# EAGLE design TubeAmp_driver (EAGLE 7.2.0)
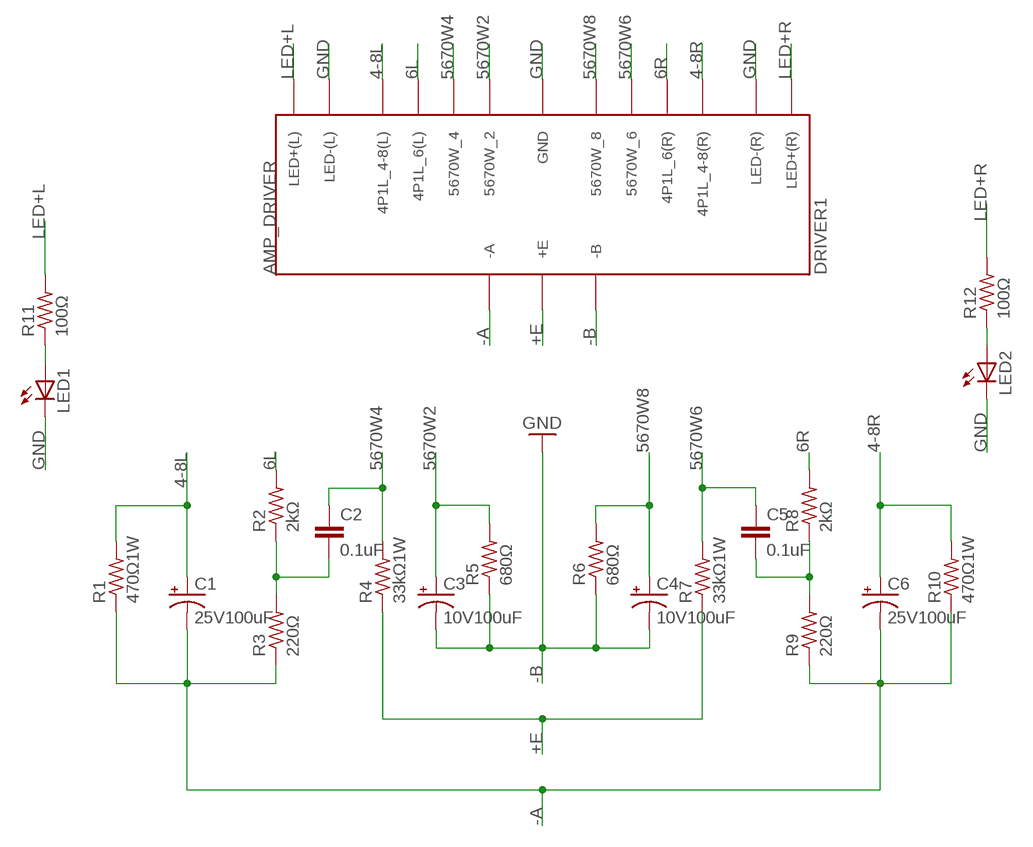
[diagram p0: schematic, sheet 1]

## Parts
C1  25V100uF  CAPACITOR2S3_NO_VALUE  [100UF25V_S3_NO_VALUE]
C2  0.1uF  CAPACITOR1C12.5_NO_VALUE  [C12.5B6_NO_VALUE]
C3  10V100uF  CAPACITOR2S3_NO_VALUE  [100UF25V_S3_NO_VALUE]
C4  10V100uF  CAPACITOR2S3_NO_VALUE  [100UF25V_S3_NO_VALUE]
C5  0.1uF  CAPACITOR1C12.5_NO_VALUE  [C12.5B6_NO_VALUE]
C6  25V100uF  CAPACITOR2S3_NO_VALUE  [100UF25V_S3_NO_VALUE]
DRIVER1  AMP_DRIVER  [AMP_DRIVER]
LED1  LED  [LED3MM]
LED2  LED  [LED3MM]
R1  470Ω1W  RESISTOR1W  [RESISTOR_1W]
R2  2kΩ  RESISTOR1/4W  [RESISTOR_1/4W]
R3  220Ω  RESISTOR1/4W  [RESISTOR_1/4W]
R4  33kΩ1W  RESISTOR1W  [RESISTOR_1W]
R5  680Ω  RESISTOR1/4W  [RESISTOR_1/4W]
R6  680Ω  RESISTOR1/4W  [RESISTOR_1/4W]
R7  33kΩ1W  RESISTOR1W  [RESISTOR_1W]
R8  2kΩ  RESISTOR1/4W  [RESISTOR_1/4W]
R9  220Ω  RESISTOR1/4W  [RESISTOR_1/4W]
R10  470Ω1W  RESISTOR1W  [RESISTOR_1W]
R11  100Ω  RESISTOR1/4W  [RESISTOR_1/4W]
R12  100Ω  RESISTOR1/4W  [RESISTOR_1/4W]

## Nets
4-8L [power]: C1.1(+) DRIVER1.4P1L_4-8L(4P1L_4-8(L)) R1.2
4-8R [power]: C6.1(+) DRIVER1.4P1L_4-8R(4P1L_4-8(R)) R10.2
6L [power]: DRIVER1.4P1L_6L(4P1L_6(L)) R2.2
6R [power]: DRIVER1.4P1L_6R(4P1L_6(R)) R8.2
5670W2 [power]: C3.1(+) DRIVER1.5670W_2 R5.2
5670W4 [power]: C2.1 DRIVER1.5670W_4 R4.2
5670W6 [GND]: C5.1 DRIVER1.5670W_6 R7.2
5670W8 [power]: C4.1(+) DRIVER1.5670W_8 R6.2
+E [power]: DRIVER1.+E R4.1 R7.1
-A [power]: C1.2(-) C6.2(-) DRIVER1.-A R1.1 R3.1 R9.1 R10.1
-B [GND]: C3.2(-) C4.2(-) DRIVER1.-B R5.1 R6.1 ; supply symbol labelled GND
GND [power]: DRIVER1.GND DRIVER1.LED-_L(LED-(L)) DRIVER1.LED-_R(LED-(R)) LED1.K(C) LED2.K(C)
LED+L: DRIVER1.LED+_L(LED+(L)) R11.2
LED+R: DRIVER1.LED+_R(LED+(R)) R12.2
N$2 [power]: C2.2 R2.1 R3.2
N$6: LED1.A R11.1
N$7: LED2.A R12.1
N$11 [power]: C5.2 R8.1 R9.2

## Library data of the parts
C1 C3 C4 C6 = mylib:CAPACITOR2
C2 C5 = mylib:CAPACITOR1
DRIVER1 = mylib:AMP_DRIVER
LED1 LED2 = mylib:LED
R1-R12 = mylib:RESISTOR

## Net classes
1 GND: width 0.381 mm, drill 0.152 mm
2 power: width 0.381 mm, drill 0.127 mm
3 edit: width 0.051 mm, drill 0.025 mm

## Board
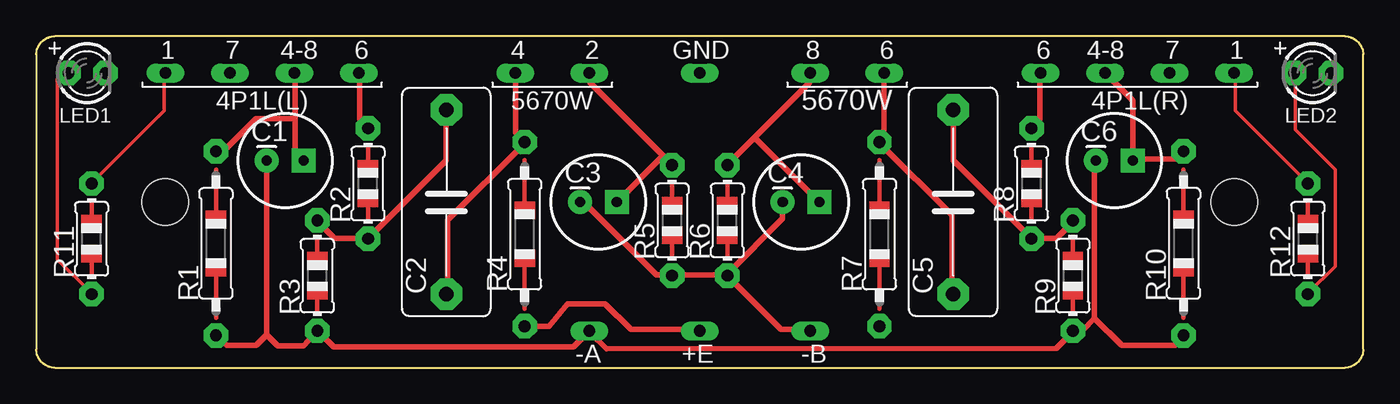
[diagram p1: board, top side]
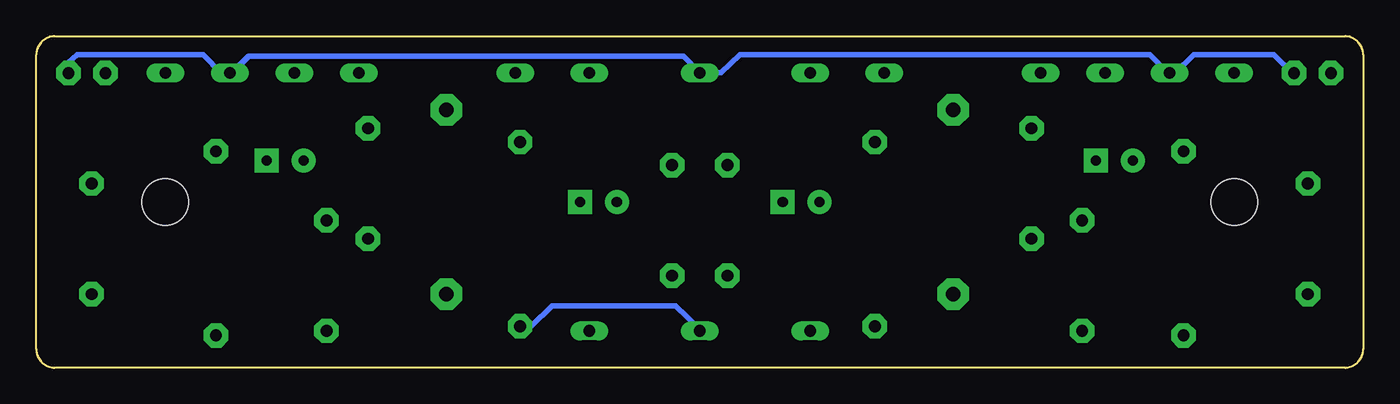
[diagram p2: board, bottom side, seen from below]

Size 91.44 x 22.86 mm. Coordinates in mm from the lower left corner, seen from the top.
Copper layers (1*16): Top 0.035mm / dielectric 1.5mm / Bottom 0.035mm
Design rules "default": minimum track width 10mil, minimum drill 24mil, track to track 8mil, track to pad 8mil, pad to pad 8mil, via to via 8mil, smd to smd 8mil, copper to edge 40mil, drill to drill 8mil, minimum pad ring 10mil, minimum via ring 8mil, stop-mask expansion 4mil, vias tented up to drill 0mil, thermal gap 10mil

### Footprints (pad centres in the part's own frame; a part is rotated, then mirrored left to right if it is on the bottom)
100UF25V_S3_NO_VALUE = drill 0.7 pad 1.651 square: 1 1.27,0 | drill 0.7 pad 1.651: 2 -1.27,0
C12.5B6_NO_VALUE = drill 1.016 pad 2.159 octagon: 1 1.27,2.54; 2 13.97,2.54
AMP_DRIVER = drill 0.8 long: 4P1L_4-8L 17.78,20.32; 4P1L_4-8R 73.66,20.32; 4P1L_6L 22.225,20.32; 4P1L_6R 69.215,20.32; 5670W_2 38.1,20.32; 5670W_4 33.02,20.32; 5670W_6 58.42,20.32; 5670W_8 53.34,20.32; +E 45.72,2.54; -A 38.1,2.54; -B 53.34,2.54; GND 45.72,20.32; LED+_L 8.89,20.32; LED+_R 82.55,20.32; LED-_L 13.335,20.32; LED-_R 78.105,20.32 | hole 3.2: 8.89,11.43; 82.55,11.43
LED3MM = drill 0.813 pad 1.676 octagon: A -1.27,0; K 1.27,0
RESISTOR_1W = drill 0.813 pad 1.676 octagon: 1 -6.35,0; 2 6.35,0
RESISTOR_1/4W = drill 0.813 pad 1.676 octagon: 1 -3.81,0; 2 3.81,0

### Placement (x,y rotation side)
C1  17.14,14.29 0 top
C2  30.8,3.81 90 top
C3  38.73,11.43 0 top
C4  52.7,11.43 0 top
C5  65.72,3.81 90 top
C6  74.3,14.29 0 top
DRIVER1  0,0 0 top
LED1  3.49,20.32 0 top
LED2  87.95,20.32 0 top
R1  12.38,8.57 90 top
R2  22.86,12.7 90 top
R3  19.37,6.35 90 top
R4  33.66,9.21 90 top
R5  43.81,10.16 90 top
R6  47.62,10.16 90 top
R7  58.1,9.21 90 top
R8  68.58,12.7 90 top
R9  71.44,6.35 90 top
R10  79.06,8.57 90 top
R11  3.81,8.89 90 top
R12  87.63,8.89 90 top

### Tracks (layer width: path | path; a pad name or v marks a point on that pad's centre or on a via)
4-8L
  Top 0.381: 17.83,17.17 17.83,14.86 C1.1 | 17.83,17.17 17.83,20.23 DRIVER1.4P1L_4-8L | 17.83,17.17 15.16,17.17 12.96,14.97 12.46,14.97 R1.2
4-8R
  Top 0.381: DRIVER1.4P1L_4-8R 73.72,20.23 75.55,18.42 75.55,15.08 C6.1 75.67,14.4 78.7,14.38 78.98,14.86 R10.2
6L
  Top 0.381: DRIVER1.4P1L_6L 22.29,20.23 22.29,17.14 22.86,16.57 R2.2
6R
  Top 0.381: DRIVER1.4P1L_6R 69.15,20.23 69.15,17.14 68.58,16.57 R8.2
5670W2
  Top 0.381: 43.2,14.63 43.78,14.06 R5.2 | 43.2,14.63 38.18,19.66 38.18,20.23 DRIVER1.5670W_2 | 43.2,14.63 C3.1
5670W4
  Top 0.381: DRIVER1.5670W_4 33.03,20.23 33.03,16.23 33.6,15.66 R4.2 33.6,15.43 28.35,10.17 28.35,5.14 C2.1
5670W6
  Top 0.381: DRIVER1.5670W_6 58.41,20.23 58.41,15.89 58.18,15.66 R7.2 58.18,15.43 63.09,10.52 63.09,5.14 C5.1
5670W8
  Top 0.381: 49.49,15.89 47.66,14.06 R6.2 | 49.49,15.89 53.26,19.66 53.26,20.23 DRIVER1.5670W_8 | 49.49,15.89 53.95,11.43 C4.1
+E
  Top 0.381: DRIVER1.+E 45.72,2.63 40.99,2.63 39.2,4.41 36.62,4.41 35.35,2.86 R4.1
  Bottom 0.381: R7.1 57.35,2.86 55.91,4.25 47.38,4.25 45.72,2.63 DRIVER1.+E
-A
  Top 0.381: 72.92,3.4 72.92,14.29 C6.2 | 72.92,3.4 72.07,2.55 R9.1 71.32,2.4 71.18,2.24 70.31,1.33 39.29,1.29 38.18,2.4 DRIVER1.-A 38.06,2.52 38.11,2.52 37.03,1.44 20.5,1.44 19.43,2.52 R3.1 18.41,1.52 16.63,1.51 16.63,1.5 15.89,2.25 | 72.92,3.4 74.79,1.53 78.5,1.53 R10.1 | 15.89,2.25 C1.2 | 15.89,2.25 15.17,1.54 13.13,1.53 R1.1
-B
  Top 0.381: C3.2 37.72,11.43 42.75,6.4 43.78,6.4 R5.1 44.01,6.4 47.55,6.4 R6.1 | DRIVER1.-B 53.26,2.63 51.32,2.63 47.66,6.29 R6.1 | C4.2 51.44,10.29 47.66,6.51 R6.1
GND
  Bottom 0.381: LED2.K 89.23,21.02 88.61,21.59 79.94,21.59 78.68,20.27 78.18,20.23 DRIVER1.LED-_R 77.95,20.34 76.85,21.46 76.82,21.49 46.83,21.49 45.83,20.46 DRIVER1.GND 45.72,20.34 44.24,20.34 42.94,21.57 14.71,21.57 13.49,20.34 DRIVER1.LED-_L 13.26,20.23 13.04,20.23 11.69,21.58 6.15,21.58 4.8,20.23 LED1.K
LED+L
  Top 0.254: DRIVER1.LED+_L 8.8,20.23 8.8,17.72 3.89,12.8 R11.2
LED+R
  Top 0.254: DRIVER1.LED+_R 82.64,20.23 82.64,17.72 87.55,12.8 R12.2
N$2
  Top 0.381: R3.2 19.43,10.06 20.57,8.91 22.86,8.91 R2.1 22.97,9.03 28.23,14.29 28.23,17.72 C2.2
N$6
  Top 0.254: LED1.A 1.45,19.91 1.45,7.46 3.77,5.14 R11.1
N$7
  Top 0.254: LED2.A 86.75,20.23 86.75,16.43 89.53,13.66 89.53,7 87.67,5.14 R12.1
N$11
  Top 0.381: R9.2 71.44,10.06 70.29,8.91 68.58,8.91 R8.1 68.47,9.03 63.21,14.29 63.21,17.72 C5.2